# EAGLE design TeamG_PCB (EAGLE 9.6.2)
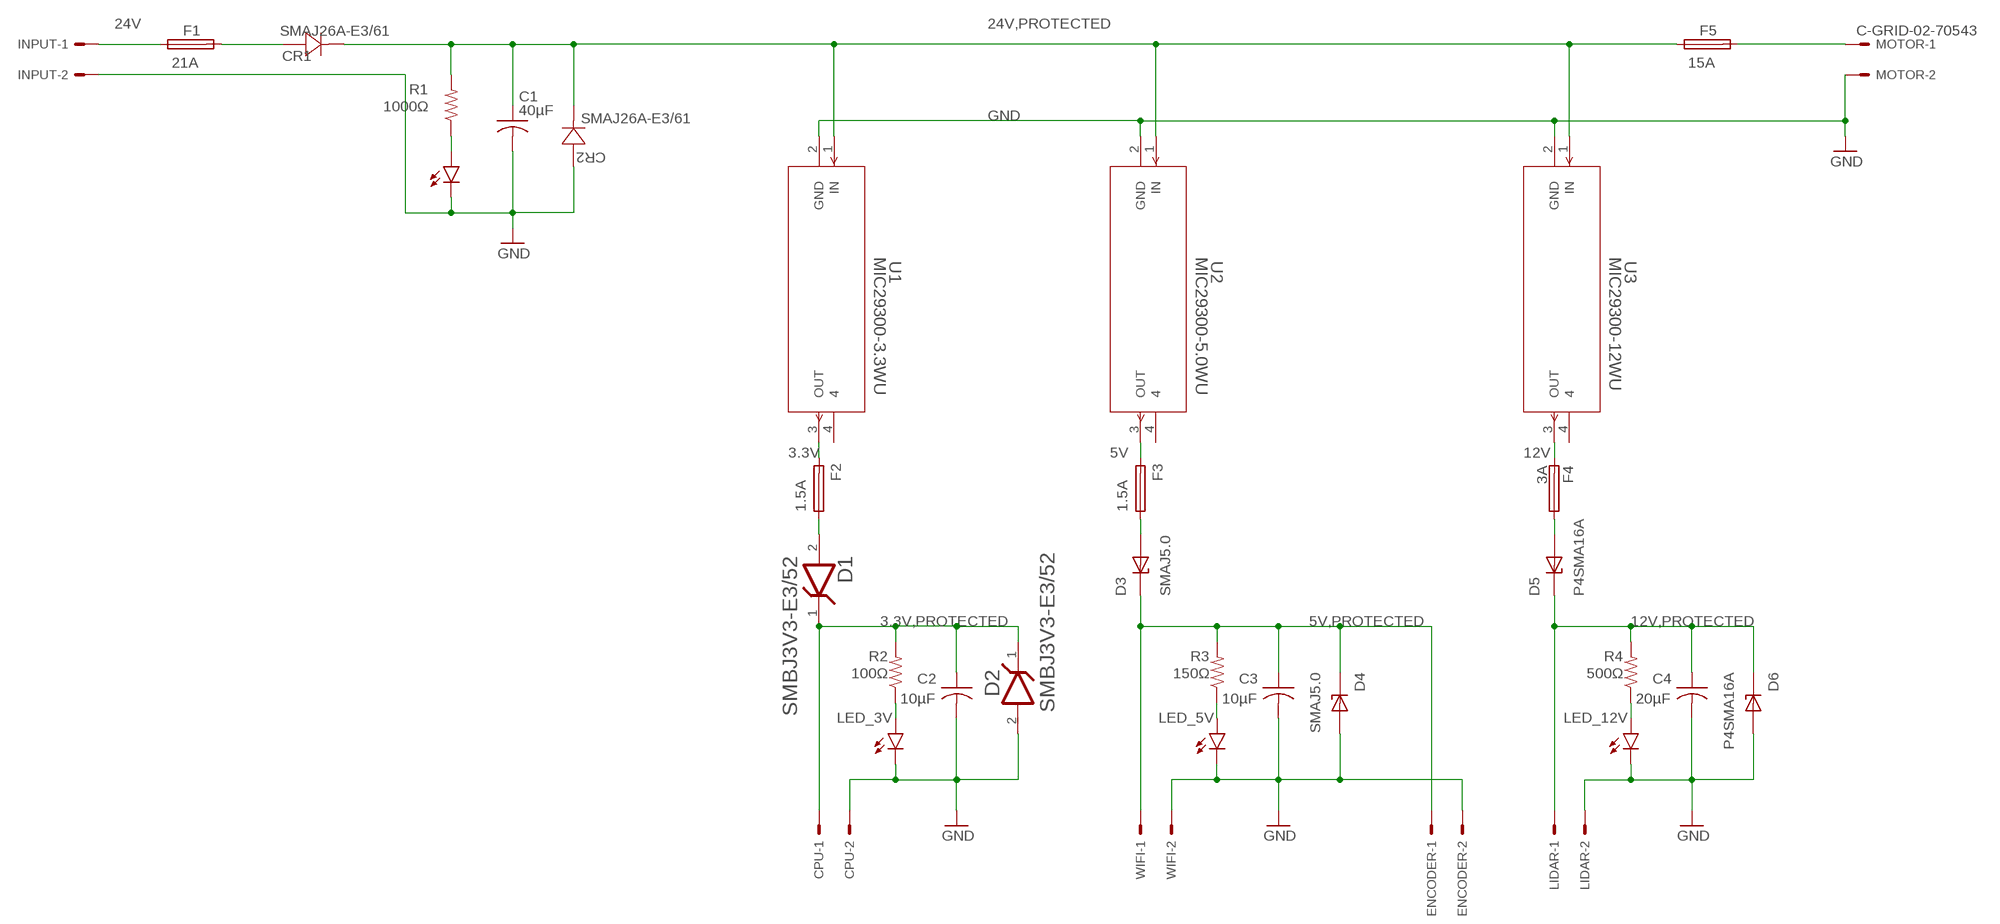
[diagram p0: schematic, sheet 1]

## Parts
24VLED  0  LEDSMT1206  [1206]
C1  40µF  C-USC1210  [C1210]
C2  10µF  C-USC1210  [C1210]
C3  10µF  C-USC1210  [C1210]
C4  20µF  C-USC1210  [C1210]
CPU  C-GRID-02-70543  [70543-02]
CR1  SMAJ26A-E3/61  [DIODE_DO-214AC]
CR2  SMAJ26A-E3/61  [DIODE_DO-214AC]
D1  VISHAY_SMBJ3V3-E3-52VISHAY_SMBJ3V3-E3-52_0_0  [VISHAY_SMBJ3V3-E3-52_0]
D2  VISHAY_SMBJ3V3-E3-52VISHAY_SMBJ3V3-E3-52_0_0  [VISHAY_SMBJ3V3-E3-52_0]
D3  SMAJ5.0  [DIOM4325X250N]
D4  SMAJ5.0  [DIOM4325X250N]
D5  P4SMA16A  [DIOM4325X250N]
D6  P4SMA16A  [DIOM4325X250N]
ENCODER  C-GRID-02-70543  [70543-02]
F1  21A  TE5  [TE5]
F2  1.5A  TE5  [TE5]
F3  1.5A  TE5  [TE5]
F4  3A  TE5  [TE5]
F5  15A  TE5  [TE5]
INPUT  5566-2  [5566-2]
LED_3V  0  LEDSMT1206  [1206]
LED_5V  0  LEDSMT1206  [1206]
LED_12V  0  LEDSMT1206  [1206]
LIDAR  C-GRID-02-70543  [70543-02]
MOTOR  C-GRID-02-70543  [70543-02]
R1  1000Ω  R-US_R1206  [R1206]
R2  100Ω  R-US_R1206  [R1206]
R3  150Ω  R-US_R1206  [R1206]
R4  500Ω  R-US_R1206  [R1206]
U1  MIC29300-3.3WU  [TO-263-3_MCL]
U2  MIC29300-5.0WU  [TO-263-3_MCL]
U3  MIC29300-12WU  [TO-263-3_MCL]
WIFI  C-GRID-02-70543  [70543-02]

## Nets
3.3V: F2.2 U1.3(OUT)
3.3V,PROTECTED: C2.1 CPU.1 D1.1(CATHODE) D2.1(CATHODE) R2.2
5V: F3.2 U2.3(OUT)
5V,PROTECTED [5V_SAFE]: C3.1 D3.C D4.C ENCODER.1 R3.2 WIFI.1
12V: F4.2 U3.3(OUT)
12V,PROTECTED [12V_SAFE]: C4.1 D5.C D6.C LIDAR.1 R4.2
24V: F1.1 INPUT.1
24V,PROTECTED [24V_SAFE]: C1.1 CR1.1 CR2.1 F5.1 R1.2 U1.1(IN) U2.1(IN) U3.1(IN)
GND [GND]: 24VLED.C C1.2 C2.2 C3.2 C4.2 CPU.2 CR2.2 D2.2(ANODE) D4.A D6.A ENCODER.2 INPUT.2 LED_3V.C LED_5V.C LED_12V.C LIDAR.2 MOTOR.2 U1.2(GND) U2.2(GND) U3.2(GND) WIFI.2
MOTOR_24V [MOTOR_24V_SAFE]: F5.2 MOTOR.1
N$1: D1.2(ANODE) F2.1
N$2: CR1.2 F1.2
N$3: LED_12V.A R4.1
N$4: D5.A F4.1
N$5: 24VLED.A R1.1
N$6: LED_3V.A R2.1
N$7: LED_5V.A R3.1
N$8: D3.A F3.1
Unconnected: U1.4 U2.4 U3.4

## Library data of the parts
24VLED LED_3V LED_5V LED_12V = led:LED: LED OSRAM: - CHIPLED LG R971, LG N971, LY N971, LG Q971, LY Q971, LO R971, LY R971 LH N974, LH R974 LS Q976, LO Q976, LY Q976 LO Q996 - Hyper CHIPLED LW Q18S LB Q993, LB Q99A, LB R99A - SideLED LS A670, LO A670, LY A670, LG A670, LP A670 LB A673, LV A673, LT A673, LW A673 LH A674 LY A675 LS A676, LA A676, LO A676, LY A676, LW A676 LS A679, LY A679, LG A679 - Hyper Micro SIDELED® LS Y876, LA Y876, LO Y876, LY Y876 LT Y87S - SmartLED LW L88C, LW L88S LB L89C, LB L89S, LG L890 LS L89K, LO L89K, LY L89K LS L896, LA L896, LO L896, LY L896 - TOPLED LS T670, LO T670, LY T670, LG T670, LP T670 LSG T670, LSP T670, LSY T670, LOP T670, LYG T670 LG T671, LOG T671, LSG T671 LB T673, LV T673, LT T673, LW T673 LH T674 LS T676, LA T676, LO T676, LY T676, LB T676, LH T676, LSB T676, LW T676 LB T67C, LV T67C, LT T67C, LS T67K, LO T67K, LY T67K, LW E67C LS E67B, LA E67B, LO E67B, LY E67B, LB E67C, LV E67C, LT E67C LW T67C LS T679, LY T679, LG T679 LS T770, LO T770, LY T770, LG T770, LP T770 LB T773, LV T773, LT T773, LW T773 LH T774 LS E675, LA E675, LY E675, LS T675 LS T776, LA T776, LO T776, LY T776, LB T776 LHGB T686 LT T68C, LB T68C - Hyper Mini TOPLED® LB M676 - Mini TOPLED Santana® LG M470 LS M47K, LO M47K, LY M47K Source: http://www.osram.convergy.de LUXEON: - LUMILED® LXK2-PW12-R00, LXK2-PW12-S00, LXK2-PW14-U00, LXK2-PW14-V00 LXK2-PM12-R00, LXK2-PM12-S00, LXK2-PM14-U00 LXK2-PE12-Q00, LXK2-PE12-R00, LXK2-PE12-S00, LXK2-PE14-T00, LXK2-PE14-U00 LXK2-PB12-K00, LXK2-PB12-L00, LXK2-PB12-M00, LXK2-PB14-N00, LXK2-PB14-P00, LXK2-PB14-Q00 LXK2-PR12-L00, LXK2-PR12-M00, LXK2-PR14-Q00, LXK2-PR14-R00 LXK2-PD12-Q00, LXK2-PD12-R00, LXK2-PD12-S00 LXK2-PH12-R00, LXK2-PH12-S00 LXK2-PL12-P00, LXK2-PL12-Q00, LXK2-PL12-R00 Source: www.luxeon.com KINGBRIGHT: KA-3528ASYC Source: www.kingbright.com
C1-C4 = rcl:C-US: CAPACITOR, American symbol; SPICEPREFIX: C
CPU ENCODER LIDAR MOTOR WIFI = con-molex:C-GRID-02: CONNECTOR wire to board 2.54 mm (0.100") pitch header; MF: MOLEX; OC_FARNELL: unknown; OC_NEWARK: unknown
CR1 CR2 = SMAJ26A-E361:SMAJ26A-E3/61; COPYRIGHT: Copyright (C) 2022 Ultra Librarian. All rights reserved.; DIGI-KEY_PART_NUMBER_1: SMAJ26A-E3/61GICT-ND; DIGI-KEY_PART_NUMBER_2: SMAJ26A-E3/61GIDKR-ND; DIGI-KEY_PART_NUMBER_3: SMAJ26A-E3/61GITR-ND; MANUFACTURER_PART_NUMBER: SMAJ26A-E3/61; MFR_NAME: Vishay
D1 D2 = SMBJ3V3-E352:VISHAY_SMBJ3V3-E3-52: Surface Mount TRANSZORB® Transient Voltage Suppressors; BREAKDOWN_VOLTAGE: 4.1V; CAPACITANCE: 5.2nF; CENTROID_NOT_SPECIFIED: No; CLAMPING_VOLTAGE: 10.3V; DATASHEET: http://www.vishay.com/docs/88940/smbj3v3.pdf; DEVICE_CLASS_L1: Circuit Protection; DEVICE_CLASS_L2: TVS Diodes; DEVICE_CLASS_L3: unset; DIGIKEY_DESCRIPTION: DIODE TVS DIODE 3.3V 10.3V DO214AA; DIGIKEY_PART_NUMBER: SMBJ3V3-E3/52GICT-ND; DIRECTION: Unidirectional; HEIGHT: 2.44mm; LEAD_FREE: yes; MAX_JUNCTION_TEMP: +175°C; MF: Vishay; MFG_PACKAGE_IDENT: SMBJ; MFG_PACKAGE_IDENT_DATE: 13/12/2013; MFG_PACKAGE_IDENT_REV: 0; MOUSER_DESCRIPTION: Diode: transil; 600W; 4.1V; 50A; unidirectional; SMB; TransZorb®; MOUSER_PART_NUMBER: 625-SMBJ3V3-E3; MPN: SMBJ3V3-E3/52; NUMBER_OF_CHANNELS: 1; PACKAGE: DO-214AA; PEAK_PULSE_CURRENT: 200A; PREFIX: D; REVERSE_STANDOFF_VOLTAGE: 3.3V; ROHS: yes; STANDOFF_HEIGHT: 0mm; VERIFICATION_VERSION: 0.0.0.1
D3 D4 = SMAJ5.0:SMAJ5.0: Check availability <https://pricing.snapeda.com/parts/SMAJ5.0/Taiwan%20Semiconductor/view-part?ref=eda>; AVAILABILITY: In Stock; DESCRIPTION: 400W, 6.9V, 10%, Unidirectional, TVS; MF: Taiwan Semiconductor; MP: SMAJ5.0; PACKAGE: SMA-2 Taiwan Semiconductor; PRICE: None; PURCHASE-URL: https://pricing.snapeda.com/search/part/SMAJ5.0/?ref=eda
D5 D6 = P4SMA16A:P4SMA16A: Check availability <https://pricing.snapeda.com/parts/P4SMA16A/Taiwan%20Semiconductor/view-part?ref=eda>; AVAILABILITY: In Stock; DESCRIPTION: 400W, 16V, 5%, Unidirectional, TVS; MF: Taiwan Semiconductor; MP: P4SMA16A; PACKAGE: SMA-2 Taiwan Semiconductor; PRICE: None; PURCHASE-URL: https://pricing.snapeda.com/search/part/P4SMA16A/?ref=eda
F1-F5 = fuse:TE5: FUSE Wickmann; OC_FARNELL: unknown; OC_NEWARK: unknown
INPUT = con-molex:5566-2: Mini FIT connector 2 pol Source: http://www.molex.com
R1-R4 = rcl:R-US_: RESISTOR, American symbol; SPICEPREFIX: R
U1 = MIC29300-3.3WU:MIC29300-3.3WU; COPYRIGHT: Copyright (C) 2022 Ultra Librarian. All rights reserved.; DIGI-KEY_PART_NUMBER_1: 576-1120-ND; MANUFACTURER_PART_NUMBER: MIC29300-3.3WU; MFR_NAME: Micrel
U2 = MIC29300-5.0WU:MIC29300-5.0WU; COPYRIGHT: Copyright (C) 2022 Ultra Librarian. All rights reserved.; DIGI-KEY_PART_NUMBER_1: 576-1122-ND; MANUFACTURER_PART_NUMBER: MIC29300-5.0WU; MFR_NAME: Micrel
U3 = MIC29300-12WU:MIC29300-12WU; COPYRIGHT: Copyright (C) 2022 Ultra Librarian. All rights reserved.; DIGI-KEY_PART_NUMBER_1: 576-2222-ND; DIGI-KEY_PART_NUMBER_2: MIC29300-12WU-CRL-ND; MANUFACTURER_PART_NUMBER: MIC29300-12WU; MFR_NAME: Micrel

## Net classes
0 default: width 0.508 mm, clearance 0.127 mm
1 GND: width 0.508 mm, clearance 0.127 mm
2 5V_SAFE: width 1.27 mm, clearance 0.127 mm
3 24V_SAFE: width 0.508 mm, clearance 0.127 mm
4 12V_SAFE: width 1.27 mm, clearance 0.127 mm
5 3P3V_SAFE: width 1.27 mm, clearance 0.127 mm
6 MOTOR_24V_SAFE: width 0.508 mm, clearance 0.127 mm

## Board
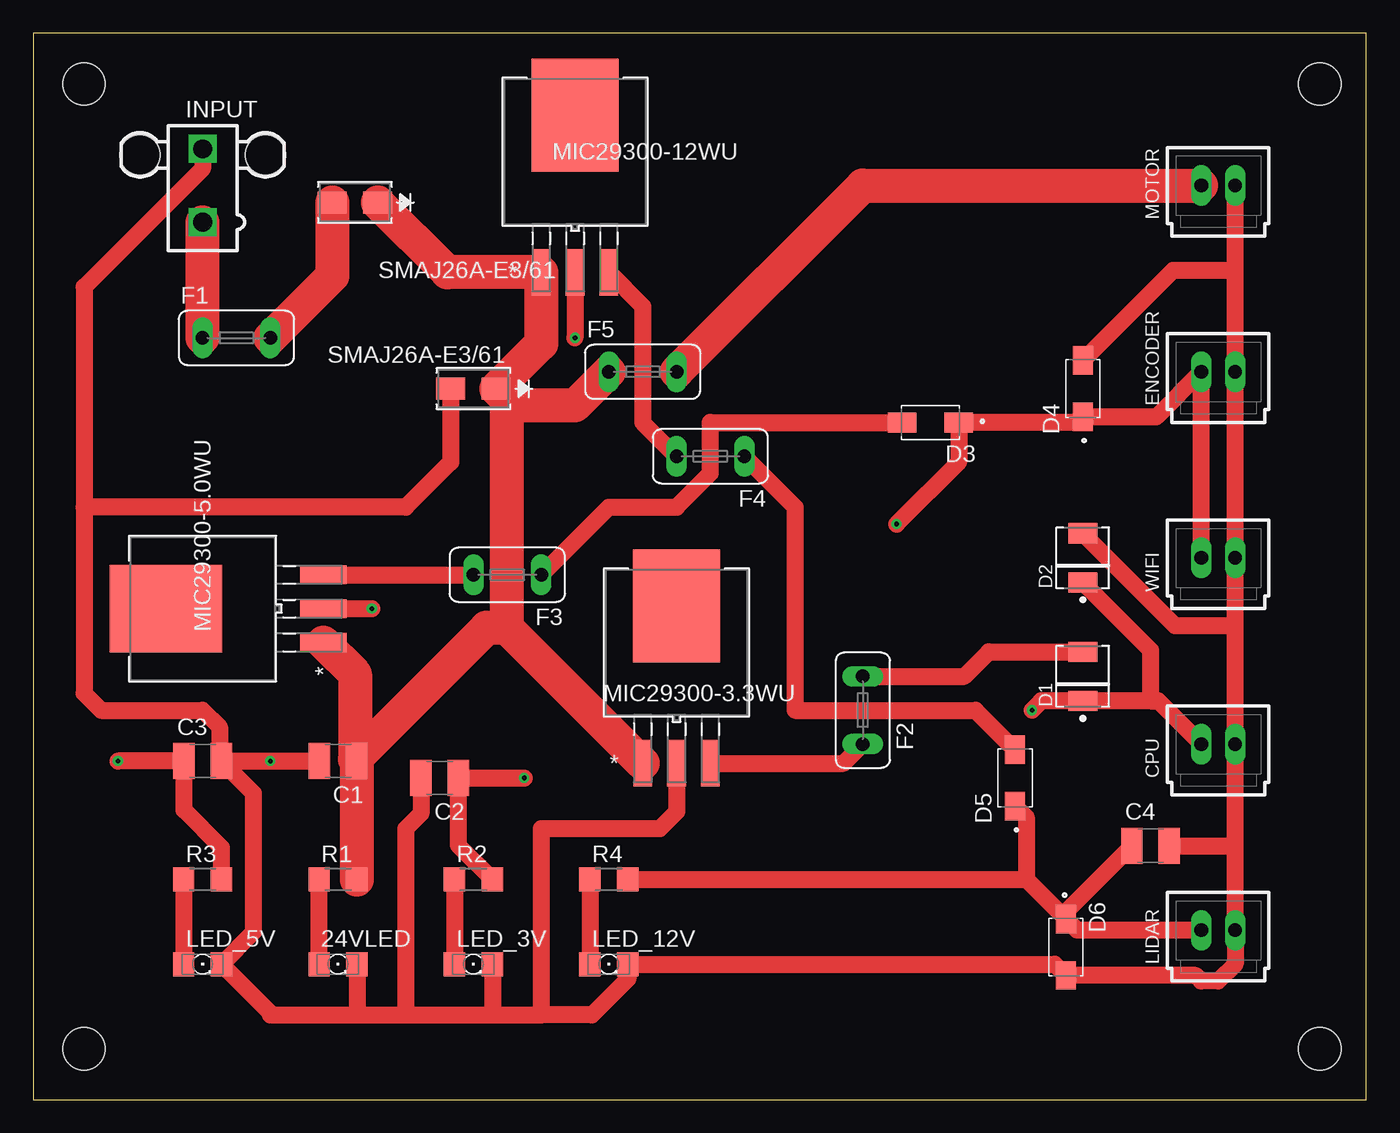
[diagram p1: board, top side]
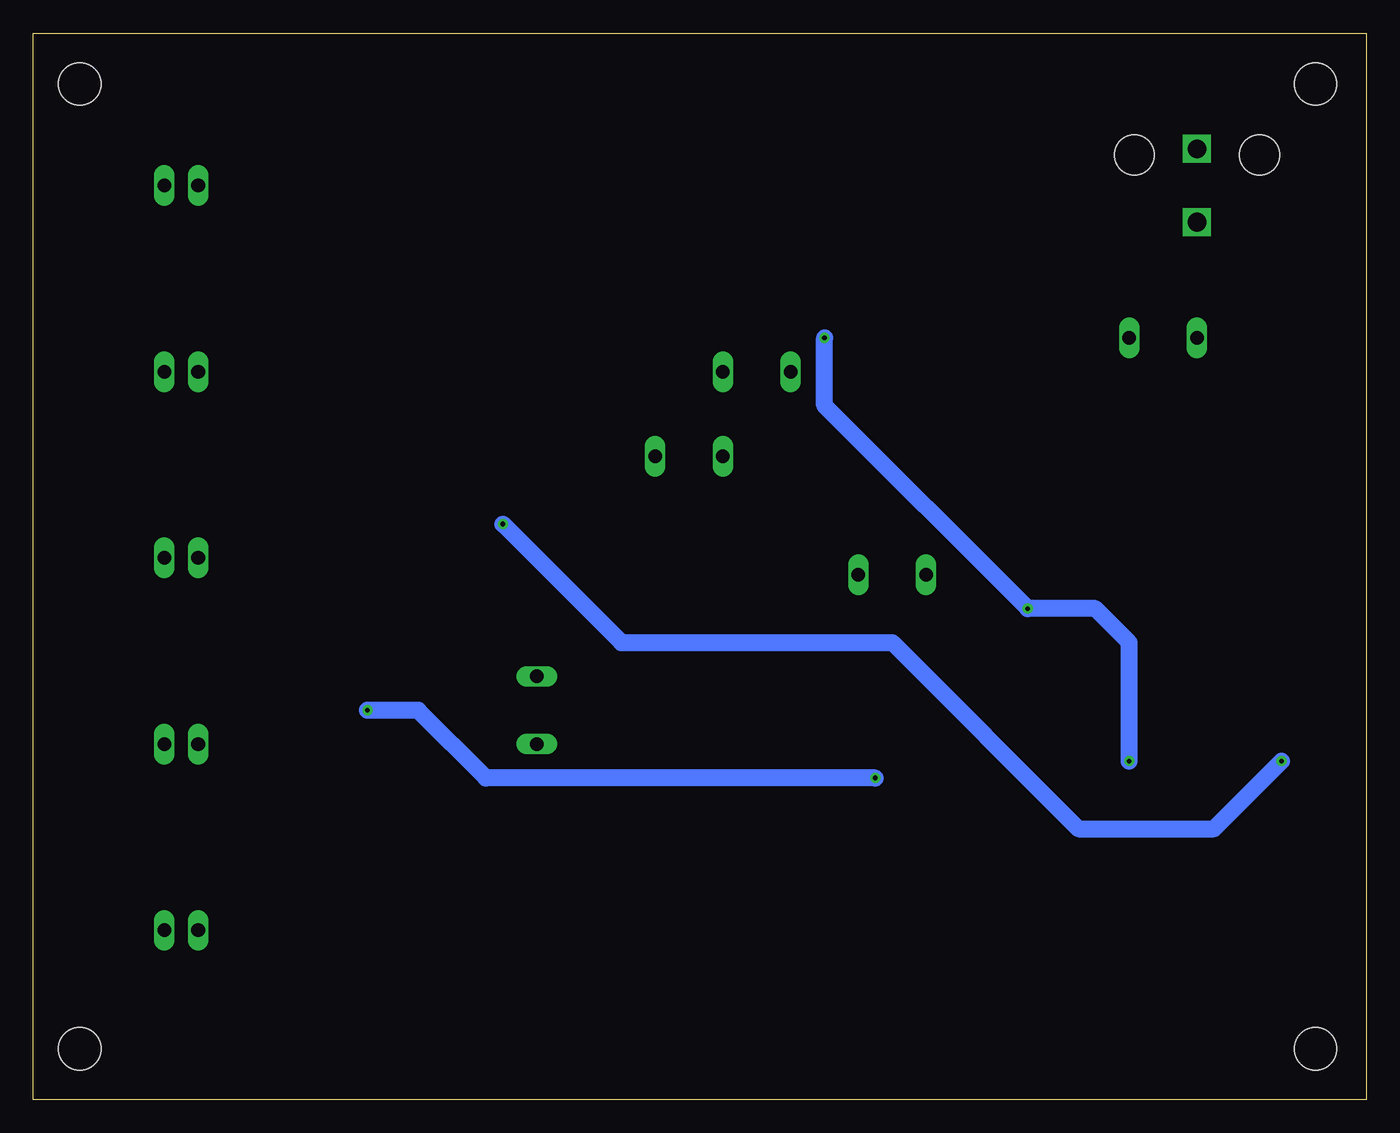
[diagram p2: board, bottom side, seen from below]

Size 100 x 80 mm. Coordinates in mm from the lower left corner, seen from the top.
Outline: 0,0 100,0 100,80 0,80 0,0
Copper layers (1*16): Top 0.035mm / dielectric 1.5mm / Bottom 0.035mm
Design rules "default *": minimum track width 6mil, minimum drill 0.35mm, track to track 6mil, track to pad 6mil, pad to pad 6mil, via to via 6mil, smd to smd 6mil, copper to edge 40mil, drill to drill 6mil, minimum pad ring 10mil, minimum via ring 8mil, stop-mask expansion 4mil, vias tented up to drill 0mil, thermal gap 10mil
Holes 3.17 mm at 3.81,3.81 96.52,3.81 96.52,76.2 3.81,76.2

### Footprints (pad centres in the part's own frame; a part is rotated, then mirrored left to right if it is on the bottom)
1206 = smd 1.6 x 1.803: A -1.422,0; C 1.422,0
C1210 = smd 1.6 x 2.7: 1 -1.4,0; 2 1.4,0
70543-02 = drill 1.016 long: 1 -1.27,0; 2 1.27,0
DIODE_DO-214AC = smd 2.184 x 1.651: 1 -1.702,0; 2 1.702,0
VISHAY_SMBJ3V3-E3-52_0 = smd 1.52 x 2.18: 1 -1.839,0; 2 1.839,0
DIOM4325X250N = smd 2.12 x 1.5: A 2.115,0; C -2.115,0
TE5 = drill 1.016 long: 1 -2.54,0; 2 2.54,0
5566-2 = drill 1.4 square: 1 0,-2.75; 2 0,2.75 | hole 3: 4.7,2.29; -4.7,2.29
R1206 = smd 1.6 x 1.803: 1 -1.422,0; 2 1.422,0
TO-263-3_MCL = smd 1.397 x 3.505: 1 -2.54,-9.055; 2 0,-9.055; 3 2.54,-9.055 | smd 6.553 x 8.458: 4 0,2.743

### Placement (x,y rotation side)
24VLED  22.86,10.16 0 top
C1  22.86,25.4 180 top
C2  30.48,24.13 180 top
C3  12.7,25.4 0 top
C4  83.82,19.05 0 top
CPU  88.9,26.67 0 top
CR1  24.13,67.31 180 top
CR2  33.02,53.34 180 top
D1  78.74,31.75 90 top
D2  78.74,40.64 90 top
D3  67.31,50.8 180 top
D4  78.74,53.34 90 top
D5  73.66,24.13 90 top
D6  77.47,11.43 270 top
ENCODER  88.9,54.61 0 top
F1  15.24,57.15 0 top
F2  62.23,29.21 270 top
F3  35.56,39.37 180 top
F4  50.8,48.26 180 top
F5  45.72,54.61 0 top
INPUT  12.7,68.58 0 top
LED_3V  33.02,10.16 0 top
LED_5V  12.7,10.16 0 top
LED_12V  43.18,10.16 0 top
LIDAR  88.9,12.7 0 top
MOTOR  88.9,68.58 0 top
R1  22.86,16.51 0 top
R2  33.02,16.51 0 top
R3  12.7,16.51 0 top
R4  43.18,16.51 0 top
U1  48.26,34.29 0 top
U2  12.7,36.83 90 top
U3  40.64,71.12 0 top
WIFI  88.9,40.64 0 top

### Tracks (layer width: path | path; a pad name or v marks a point on that pad's centre or on a via)
3.3V
  Top 1.27: U1.3 60.8,25.23 F2.2
3.3V,PROTECTED  (via drill 0.35)
  Top 1.27: 83.82,29.91 D1.1 75.63,29.91 v74.93,29.21 | 83.82,29.91 84.39,29.91 CPU.1 | D2.1 83.82,33.72 83.82,29.91 | R2.2 31.88,19.07 C2.1 v36.83,24.13
  Bottom 1.27: v36.83,24.13 66.04,24.13 71.12,29.21 v74.93,29.21
5V
  Top 1.27: U2.3 F3.2
5V,PROTECTED  (via drill 0.35)
  Top 1.27: R3.2 14.12,18.9 11.3,21.72 C3.1 v6.35,25.4 | WIFI.1 ENCODER.1 84.25,51.23 D4.C 78.31,50.8 D3.C 69.42,47.84 v64.77,43.18
  Bottom 1.27: v6.35,25.4 11.43,20.32 21.59,20.32 35.56,34.29 55.88,34.29 v64.77,43.18
12V
  Top 1.27: U3.3 45.72,59.52 45.72,50.8 F4.2
12V,PROTECTED
  Top 1.27: LIDAR.1 78.31,12.7 D6.C | R4.2 74.5,16.51 | 74.5,16.51 D6.C | D5.C 74.5,21.17 74.5,16.51 | C4.1 77.47,14.1 D6.C
24V
  Top 2.54: F1.1 INPUT.1
24V,PROTECTED
  Top 1.27: 24.13,25.53 C1.1
  Top 2.54: CR1.1 31.08,62.06 U3.1 38.1,56.72 CR2.1 35.99,52.07 | F5.1 40.64,52.07 35.99,52.07 | 35.99,52.07 35.56,51.64 35.56,35.4 | U1.1 35.56,35.4 | 35.56,35.4 33.99,35.4 24.13,25.53 24.13,31.91 U2.1 | C1.1 24.26,16.53 R1.2
GND  (via drill 0.35)
  Top 1.27: 24.13,6.35 17.78,6.35 17.78,6.5 LED_5V.C 16.51,12.55 16.51,22.99 C3.2 | 24.13,6.35 27.94,6.35 | 27.94,6.35 34.29,6.35 | 34.29,6.35 38.1,6.35 | C3.2 v17.78,25.4 C1.2 | 24VLED.C 24.28,6.5 24.13,6.35 | LED_3V.C 34.44,6.5 34.29,6.35 | 90.17,19.05 LIDAR.2 90.17,10.16 88.9,8.89 87.62,8.89 87.2,9.31 D6.A 76.62,10.16 LED_12V.C 44.6,9.04 41.91,6.35 38.1,6.35 | 90.17,19.05 CPU.2 90.17,35.56 | 90.17,35.56 WIFI.2 ENCODER.2 90.17,62.23 | 90.17,62.23 MOTOR.2 | C4.2 90.17,19.05 | D2.2 85.66,35.56 90.17,35.56 | D4.A 85.52,62.23 90.17,62.23 | C2.2 29.08,21.46 27.94,20.32 27.94,6.35 | 38.1,6.35 38.1,20.32 46.99,20.32 48.26,21.59 U1.2 | INPUT.2 12.7,69.85 3.81,60.96 3.81,44.45 | 3.81,44.45 3.81,30.48 5.08,29.21 12.7,29.21 13.97,27.94 13.97,25.53 C3.2 | 3.81,44.45 27.94,44.45 31.32,47.83 CR2.2 | U3.2 v40.64,57.15 | U2.2 v25.4,36.83
  Bottom 1.27: v17.78,25.4 17.78,34.29 20.32,36.83 v25.4,36.83 40.64,52.07 v40.64,57.15
MOTOR_24V
  Top 2.54: F5.2 62.23,68.58 MOTOR.1
N$1
  Top 1.27: F2.1 69.85,31.75 71.69,33.59 D1.2
N$2
  Top 2.54: CR1.2 22.43,61.8 F1.2
N$3
  Top 1.27: R4.1 LED_12V.A
N$4
  Top 1.27: F4.1 57.15,44.45 57.15,29.21 70.69,29.21 D5.A
N$5
  Top 1.27: 24VLED.A R1.1
N$6
  Top 1.27: R2.1 LED_3V.A
N$7
  Top 1.27: R3.1 LED_5V.A
N$8
  Top 1.27: F3.1 43.18,44.45 48.26,44.45 50.8,46.99 50.8,50.8 D3.A